# EAGLE design STM32F103_V2 (EAGLE 6.1)
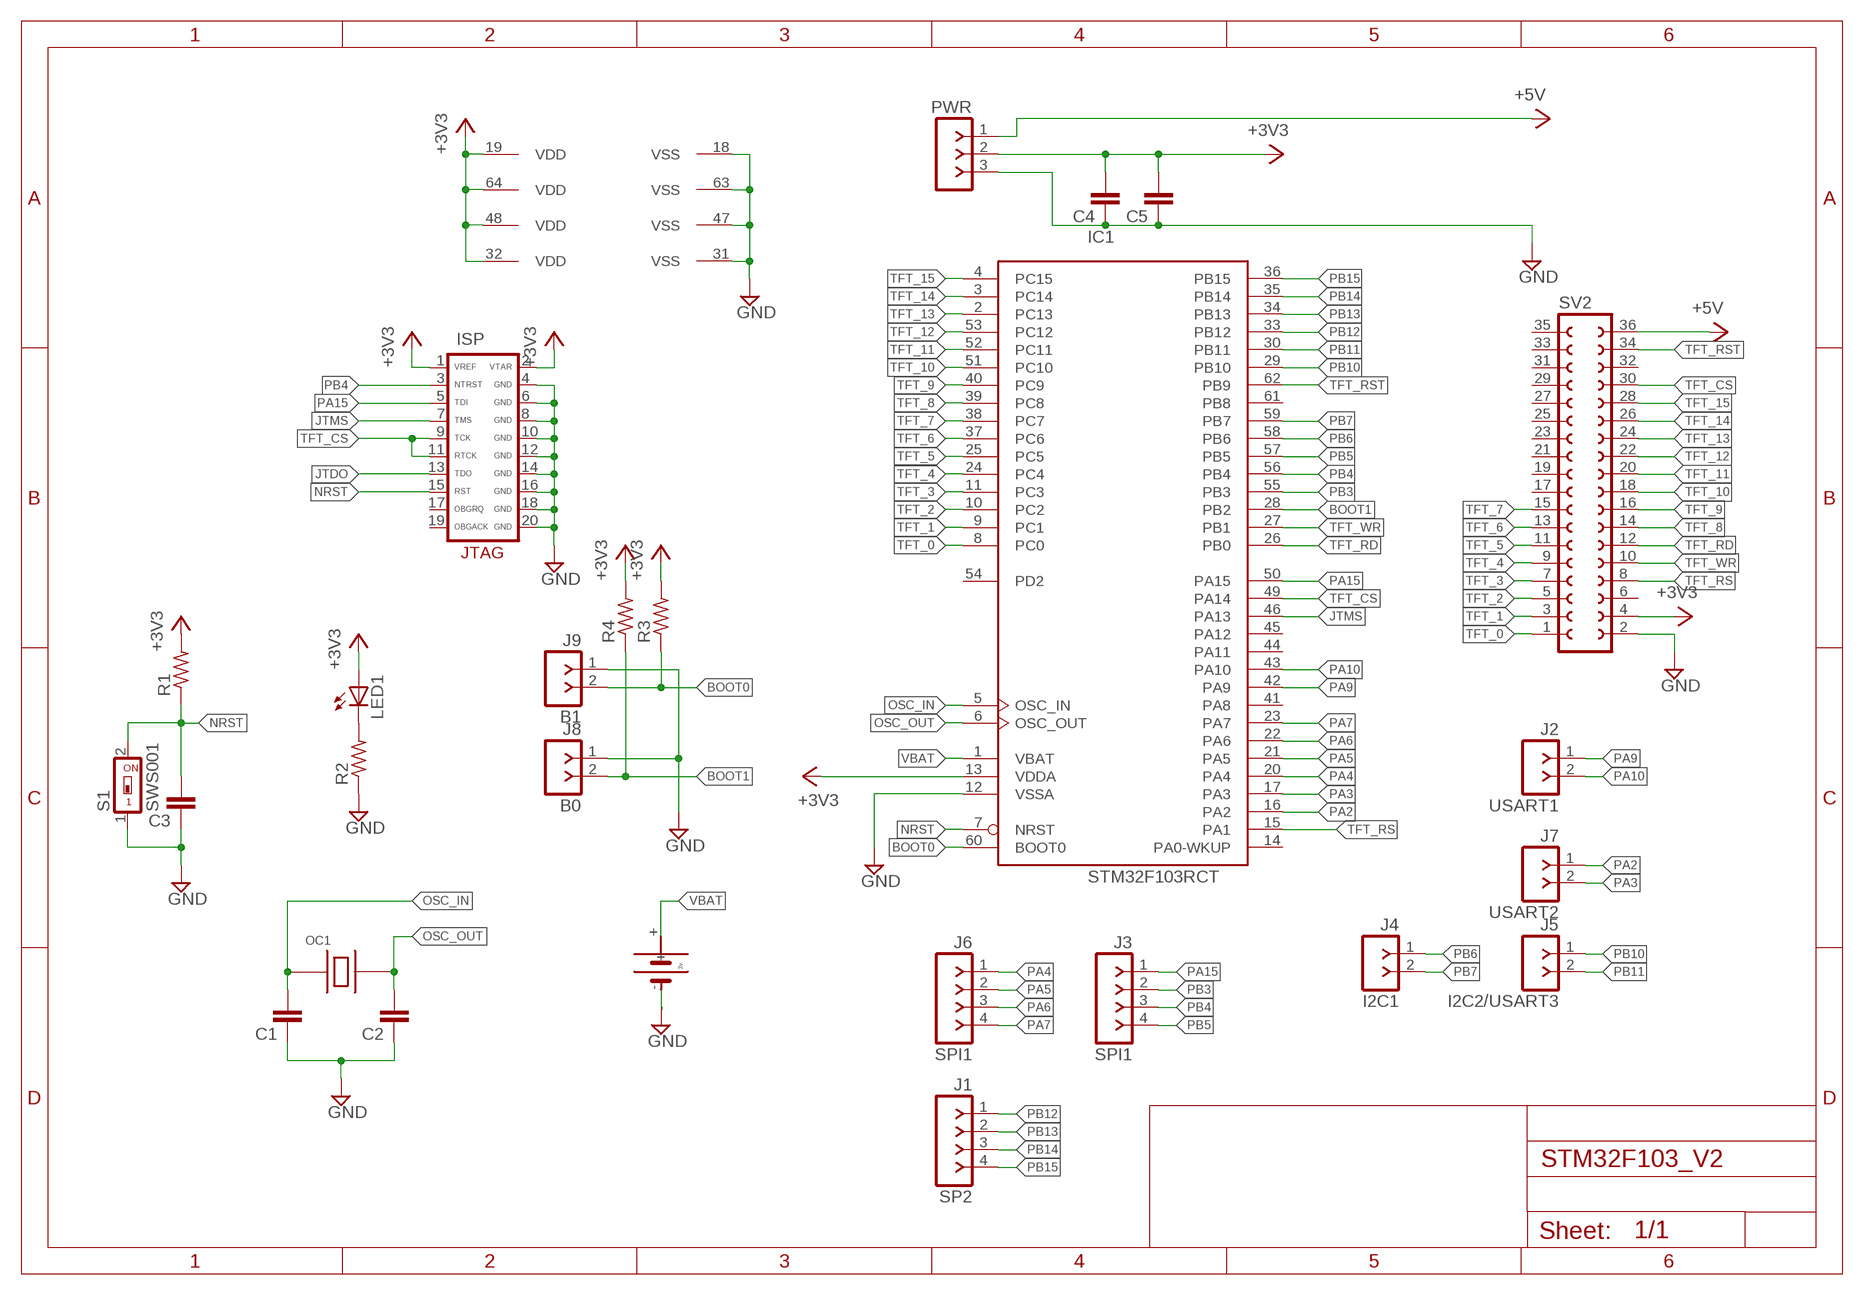
[diagram p0: schematic, sheet 1]

## Parts
C1  C-EUC1206  [C1206]
C2  C-EUC1206  [C1206]
C3  C-EUC1206  [C1206]
C4  C-EUC1206  [C1206]
C5  C-EUC1206  [C1206]
IC1  STM32F103RCT  [LQFP64]
ISP  JTAG  JTAG-ARM-PAK100/2500-20  [PAK100/2500-20]
J1  SP2  F-1X04-SIP-100-40  [SIP-100-04-40]
J2  USART1  F-1X02-SIP-100-40  [SIP-100-02-40]
J3  SPI1  F-1X04-SIP-100-40  [SIP-100-04-40]
J4  I2C1  F-1X02-SIP-100-40  [SIP-100-02-40]
J5  I2C2/USART3  F-1X02-SIP-100-40  [SIP-100-02-40]
J6  SPI1  F-1X04-SIP-100-40  [SIP-100-04-40]
J7  USART2  F-1X02-SIP-100-40  [SIP-100-02-40]
J8  B0  F-1X02-SIP-100-40  [SIP-100-02-40]
J9  B1  F-1X02-SIP-100-40  [SIP-100-02-40]
LED1  LEDSML1206  [SML1206]
OC1  SMAQ-7050B  [IQG7050B]
PWR  F-1X03-SIP-100-40  [SIP-100-03-40]
R1  R-US_R1206  [R1206]
R2  R-US_R1206  [R1206]
R3  R-US_R1206  [R1206]
R4  R-US_R1206  [R1206]
S1  SWS001  [SMS-001]
SV2  FE18-2  [FE18-2]
U$2  1220BATTERY_SF  [1220BATTERY]

## Nets
+3V3: C4.2 C5.2 IC1.13(VDDA) IC1.19(VDD) IC1.32(VDD) IC1.48(VDD) IC1.64(VDD) ISP.1(VREF) ISP.2(VTAR) LED1.A PWR.2 R1.2 R3.2 R4.2 SV2.4
+5V: PWR.1 SV2.36
BOOT0: IC1.60(BOOT0) J9.2 R3.1
BOOT1: IC1.28(PB2) J8.2 R4.1
GND: C1.1 C2.1 C3.1 C4.1 C5.1 IC1.12(VSSA) IC1.18(VSS) IC1.31(VSS) IC1.47(VSS) IC1.63(VSS) ISP.4(GND) ISP.6(GND) ISP.8(GND) ISP.10(GND) ISP.12(GND) ISP.14(GND) ISP.16(GND) ISP.18(GND) ISP.20(GND) J8.1 J9.1 PWR.3 R2.1 S1.1 SV2.2 U$2.-
JTDO: ISP.13(TDO)
JTMS: IC1.46(PA13) ISP.7(TMS)
N$1: LED1.C R2.2
NRST: C3.2 IC1.7(NRST) ISP.15(RST) R1.1 S1.2
OSC_IN: C1.2 IC1.5(OSC_IN) OC1.P$1(PIN1)
OSC_OUT: C2.2 IC1.6(OSC_OUT) OC1.P$3(PIN2)
PA2: IC1.16(PA2) J7.1
PA3: IC1.17(PA3) J7.2
PA4: IC1.20(PA4) J6.1
PA5: IC1.21(PA5) J6.2
PA6: IC1.22(PA6) J6.3
PA7: IC1.23(PA7) J6.4
PA9: IC1.42(PA9) J2.1
PA10: IC1.43(PA10) J2.2
PA15: IC1.50(PA15) ISP.5(TDI) J3.1
PB3: IC1.55(PB3) J3.2
PB4: IC1.56(PB4) ISP.3(NTRST) J3.3
PB5: IC1.57(PB5) J3.4
PB6: IC1.58(PB6) J4.1
PB7: IC1.59(PB7) J4.2
PB10: IC1.29(PB10) J5.1
PB11: IC1.30(PB11) J5.2
PB12: IC1.33(PB12) J1.1
PB13: IC1.34(PB13) J1.2
PB14: IC1.35(PB14) J1.3
PB15: IC1.36(PB15) J1.4
TFT_0: IC1.8(PC0) SV2.1
TFT_1: IC1.9(PC1) SV2.3
TFT_2: IC1.10(PC2) SV2.5
TFT_3: IC1.11(PC3) SV2.7
TFT_4: IC1.24(PC4) SV2.9
TFT_5: IC1.25(PC5) SV2.11
TFT_6: IC1.37(PC6) SV2.13
TFT_7: IC1.38(PC7) SV2.15
TFT_8: IC1.39(PC8) SV2.14
TFT_9: IC1.40(PC9) SV2.16
TFT_10: IC1.51(PC10) SV2.18
TFT_11: IC1.52(PC11) SV2.20
TFT_12: IC1.53(PC12) SV2.22
TFT_13: IC1.2(PC13) SV2.24
TFT_14: IC1.3(PC14) SV2.26
TFT_15: IC1.4(PC15) SV2.28
TFT_CS: IC1.49(PA14) ISP.9(TCK) ISP.11(RTCK) SV2.30
TFT_RD: IC1.26(PB0) SV2.12
TFT_RS: IC1.15(PA1) SV2.8
TFT_RST: IC1.62(PB9) SV2.34
TFT_WR: IC1.27(PB1) SV2.10
VBAT: IC1.1(VBAT) U$2.+
Unconnected: IC1.14(PA0-WKUP) IC1.41(PA8) IC1.44(PA11) IC1.45(PA12) IC1.54(PD2) IC1.61(PB8) ISP.17(OBGRQ) ISP.19(OBGACK) SV2.6 SV2.17 SV2.19 SV2.21 SV2.23 SV2.25 SV2.27 SV2.29 SV2.31 SV2.32 SV2.33 SV2.35

## Library data of the parts
C1-C5 = resistor:C-EU: CAPACITOR, European symbol
IC1 = micro-stm:STM32F103R*T: ARM 32-bit Cortex™-M3 CPU 72 MHz maximum frequency 16 to 1024 Kbytes of Flash memory 6 to 96 kbytes of SRAM 51 GPIOs 2.0 to 3.6 V application supply
ISP = atmel-arm:JTAG-ARM-: JTAG Programming/Debug Connector
J1 J3 J6 = con-headers-jp:F-1X04-: FEMALE HEADER
J2 J4 J5 J7-J9 = con-headers-jp:F-1X02-: FEMALE HEADER
LED1 = led:LED: LED OSRAM: - CHIPLED LG R971, LG N971, LY N971, LG Q971, LY Q971, LO R971, LY R971 LH N974, LH R974 LS Q976, LO Q976, LY Q976 LO Q996 - Hyper CHIPLED LW Q18S LB Q993, LB Q99A, LB R99A - SideLED LS A670, LO A670, LY A670, LG A670, LP A670 LB A673, LV A673, LT A673, LW A673 LH A674 LY A675 LS A676, LA A676, LO A676, LY A676, LW A676 LS A679, LY A679, LG A679 - Hyper Micro SIDELED® LS Y876, LA Y876, LO Y876, LY Y876 LT Y87S - SmartLED LW L88C, LW L88S LB L89C, LB L89S, LG L890 LS L89K, LO L89K, LY L89K LS L896, LA L896, LO L896, LY L896 - TOPLED LS T670, LO T670, LY T670, LG T670, LP T670 LSG T670, LSP T670, LSY T670, LOP T670, LYG T670 LG T671, LOG T671, LSG T671 LB T673, LV T673, LT T673, LW T673 LH T674 LS T676, LA T676, LO T676, LY T676, LB T676, LH T676, LSB T676, LW T676 LB T67C, LV T67C, LT T67C, LS T67K, LO T67K, LY T67K, LW E67C LS E67B, LA E67B, LO E67B, LY E67B, LB E67C, LV E67C, LT E67C LW T67C LS T679, LY T679, LG T679 LS T770, LO T770, LY T770, LG T770, LP T770 LB T773, LV T773, LT T773, LW T773 LH T774 LS E675, LA E675, LY E675, LS T675 LS T776, LA T776, LO T776, LY T776, LB T776 LHGB T686 LT T68C, LB T68C - Hyper Mini TOPLED® LB M676 - Mini TOPLED Santana® LG M470 LS M47K, LO M47K, LY M47K Source: http://www.osram.convergy.de LUXEON: - LUMILED® LXK2-PW12-R00, LXK2-PW12-S00, LXK2-PW14-U00, LXK2-PW14-V00 LXK2-PM12-R00, LXK2-PM12-S00, LXK2-PM14-U00 LXK2-PE12-Q00, LXK2-PE12-R00, LXK2-PE12-S00, LXK2-PE14-T00, LXK2-PE14-U00 LXK2-PB12-K00, LXK2-PB12-L00, LXK2-PB12-M00, LXK2-PB14-N00, LXK2-PB14-P00, LXK2-PB14-Q00 LXK2-PR12-L00, LXK2-PR12-M00, LXK2-PR14-Q00, LXK2-PR14-R00 LXK2-PD12-Q00, LXK2-PD12-R00, LXK2-PD12-S00 LXK2-PH12-R00, LXK2-PH12-S00 LXK2-PL12-P00, LXK2-PL12-Q00, LXK2-PL12-R00 Source: www.luxeon.com KINGBRIGHT: KA-3528ASYC Source: www.kingbright.com
OC1 = osc:SMAQ-7050B: All Quartz SMD Package SMAQ-7050B 4 Pads Pb-Free, RoHs Compliant Company Website:http://www.interquip.com/
PWR = con-headers-jp:F-1X03-: FEMALE HEADER
R1-R4 = rcl:R-US_: RESISTOR, American symbol
S1 = smd-special:SWS001: SMD Dip Switch 1 pol.
SV2 = con-lsta:FE18-2: FEMALE HEADER; OC_FARNELL: unknown; OC_NEWARK: unknown
U$2 = battery2:1220BATTERY_SF

## Board
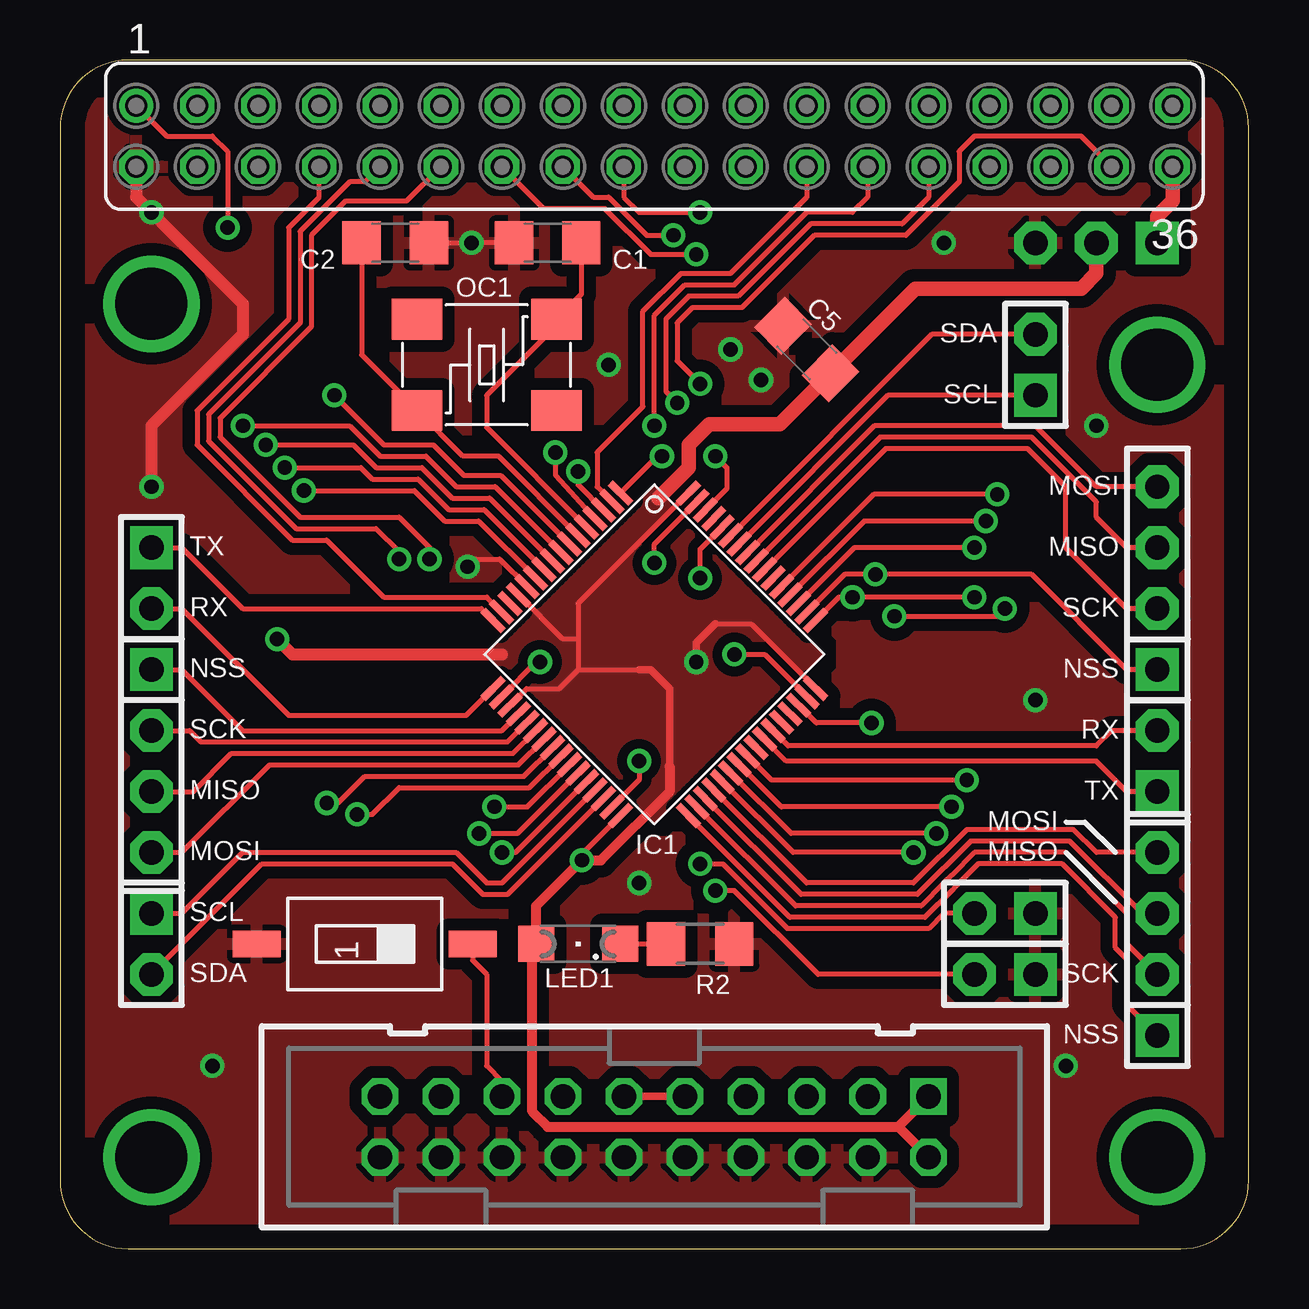
[diagram p1: board, top side]
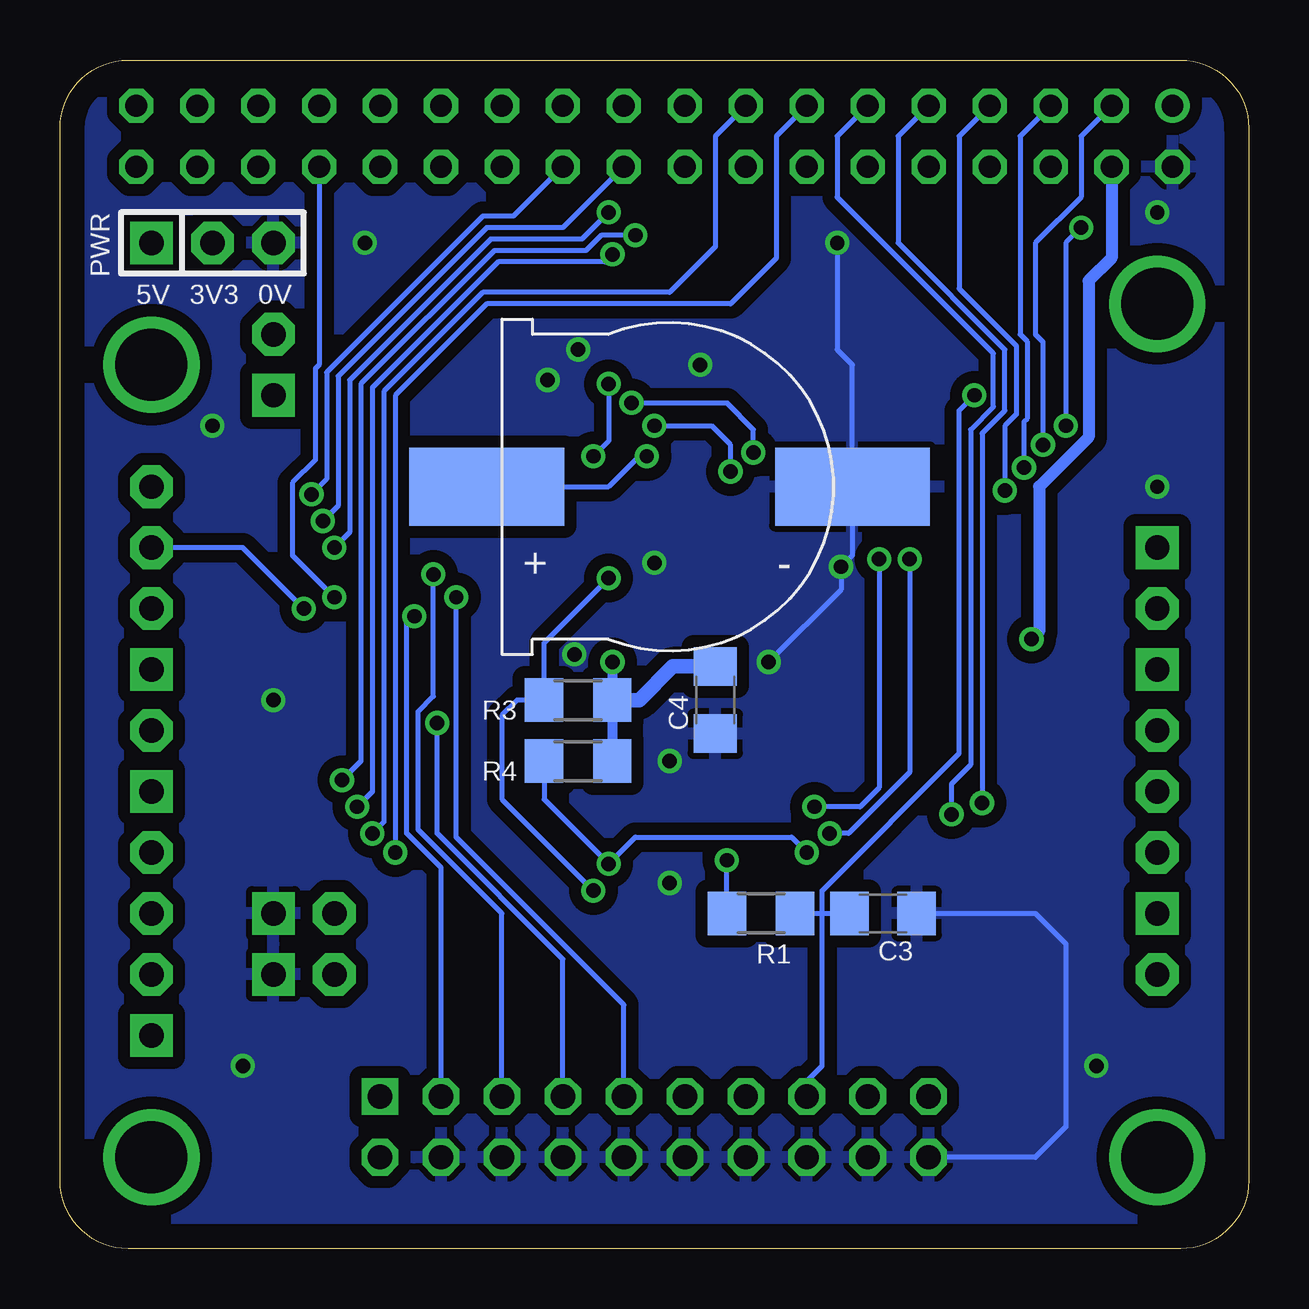
[diagram p2: board, bottom side, seen from below]

Size 49.53 x 49.53 mm. Coordinates in mm from the lower left corner, seen from the top.
Outline: 2.84,0 46.69,0 arc90 49.53,2.84 49.53,46.69 arc90 46.69,49.53 2.84,49.53 arc90 0,46.69 0,2.84 arc90 2.84,0
Copper layers (1*16): Top 0.035mm / dielectric 1.5mm / Bottom 0.035mm
Design rules: minimum track width 6mil, minimum drill 0.6mm, track to track 7mil, track to pad 7mil, pad to pad 7mil, via to via 7mil, smd to smd 7mil, copper to edge 40mil, drill to drill 8mil, minimum pad ring 10mil, minimum via ring 8mil, stop-mask expansion 4mil, vias tented up to drill 0.6mm, thermal gap 10mil

### Footprints (pad centres in the part's own frame; a part is rotated, then mirrored left to right if it is on the bottom)
C1206 = smd 1.6 x 1.8: 1 -1.4,0; 2 1.4,0
LQFP64 = smd 0.3 x 1.2: 1 -3.75,-5.75; 2 -3.25,-5.75; 3 -2.75,-5.75; 4 -2.25,-5.75; 5 -1.75,-5.75; 6 -1.25,-5.75; 7 -0.75,-5.75; 8 -0.25,-5.75; 9 0.25,-5.75; 10 0.75,-5.75; 11 1.25,-5.75; 12 1.75,-5.75; 13 2.25,-5.75; 14 2.75,-5.75; 15 3.25,-5.75; 16 3.75,-5.75; 33 3.75,5.75; 34 3.25,5.75; 35 2.75,5.75; 36 2.25,5.75; 37 1.75,5.75; 38 1.25,5.75; 39 0.75,5.75; 40 0.25,5.75; 41 -0.25,5.75; 42 -0.75,5.75; 43 -1.25,5.75; 44 -1.75,5.75; 45 -2.25,5.75; 46 -2.75,5.75; 47 -3.25,5.75; 48 -3.75,5.75 | smd 1.2 x 0.3: 17 5.75,-3.75; 18 5.75,-3.25; 19 5.75,-2.75; 20 5.75,-2.25; 21 5.75,-1.75; 22 5.75,-1.25; 23 5.75,-0.75; 24 5.75,-0.25; 25 5.75,0.25; 26 5.75,0.75; 27 5.75,1.25; 28 5.75,1.75; 29 5.75,2.25; 30 5.75,2.75; 31 5.75,3.25; 32 5.75,3.75; 49 -5.75,3.75; 50 -5.75,3.25; 51 -5.75,2.75; 52 -5.75,2.25; 53 -5.75,1.75; 54 -5.75,1.25; 55 -5.75,0.75; 56 -5.75,0.25; 57 -5.75,-0.25; 58 -5.75,-0.75; 59 -5.75,-1.25; 60 -5.75,-1.75; 61 -5.75,-2.25; 62 -5.75,-2.75; 63 -5.75,-3.25; 64 -5.75,-3.75
PAK100/2500-20 = drill 1.016 pad 1.422 square: 1 -11.43,-1.27 | drill 1.016 pad 1.422 octagon: 2 -11.43,1.27; 3 -8.89,-1.27; 4 -8.89,1.27; 5 -6.35,-1.27; 6 -6.35,1.27; 7 -3.81,-1.27; 8 -3.81,1.27; 9 -1.27,-1.27; 10 -1.27,1.27; 11 1.27,-1.27; 12 1.27,1.27; 13 3.81,-1.27; 14 3.81,1.27; 15 6.35,-1.27; 16 6.35,1.27; 17 8.89,-1.27; 18 8.89,1.27; 19 11.43,-1.27; 20 11.43,1.27
SIP-100-04-40 = drill 1.016 pad 1.778 square: 1 -3.81,0 | drill 1.016 pad 1.778 octagon: 2 -1.27,0; 3 1.27,0; 4 3.81,0
SIP-100-02-40 = drill 1.016 pad 1.778 square: 1 -1.27,0 | drill 1.016 pad 1.778 octagon: 2 1.27,0
SML1206 = smd 1.5 x 1.5: A 1.75,0; C -1.75,0
IQG7050B = smd 2.1 x 1.7: P$1 -2.9,-1.9; P$2 2.9,-1.9; P$3 2.9,1.9; P$4 -2.9,1.9
SIP-100-03-40 = drill 1.016 pad 1.778 square: 1 -2.54,0 | drill 1.016 pad 1.778 octagon: 2 0,0; 3 2.54,0
R1206 = smd 1.6 x 1.803: 1 -1.422,0; 2 1.422,0
SMS-001 = smd 1.092 x 2.007: 1 0,-4.496; 2 0,4.496
FE18-2 = drill 0.914: 1 -21.59,1.27 | drill 0.914 octagon: 2 -21.59,-1.27; 3 -19.05,1.27; 4 -19.05,-1.27; 5 -16.51,1.27; 6 -16.51,-1.27; 7 -13.97,1.27; 8 -13.97,-1.27; 9 -11.43,1.27; 10 -11.43,-1.27; 11 -8.89,1.27; 12 -8.89,-1.27; 13 -6.35,1.27; 14 -6.35,-1.27; 15 -3.81,1.27; 16 -3.81,-1.27; 17 -1.27,1.27; 18 -1.27,-1.27; 19 1.27,1.27; 20 1.27,-1.27; 21 3.81,1.27; 22 3.81,-1.27; 23 6.35,1.27; 24 6.35,-1.27; 25 8.89,1.27; 26 8.89,-1.27; 27 11.43,1.27; 28 11.43,-1.27; 29 13.97,1.27; 30 13.97,-1.27; 31 16.51,1.27; 32 16.51,-1.27; 33 19.05,1.27; 34 19.05,-1.27; 35 21.59,1.27; 36 21.59,-1.27
1220BATTERY = smd 6.452 x 3.251: + -6.985,0; - 8.255,0

### Placement (x,y rotation side)
C1  20.32,41.91 0 top
C2  13.97,41.91 180 top
C3  15.24,13.97 180 bottom
C4  22.23,22.86 90 bottom
C5  31.11,37.47 315 top
IC1  24.77,24.77 225 top
ISP  24.77,5.08 180 top
J1  45.72,12.7 90 top
J2  45.72,20.32 90 top
J3  45.72,27.94 90 top
J4  40.64,36.83 90 top
J5  3.81,12.7 270 top
J6  3.81,20.32 270 top
J7  3.81,27.94 270 top
J8  39.37,13.97 180 top
J9  39.37,11.43 180 top
LED1  21.59,12.7 180 top
OC1  17.78,36.83 180 top
PWR  43.18,41.91 0 bottom
R1  20.32,13.97 180 bottom
R2  26.67,12.7 180 top
R3  27.94,22.86 0 bottom
R4  27.94,20.32 0 bottom
S1  12.7,12.7 270 top
SV2  24.77,46.35 0 top
U$2  24.77,31.75 0 bottom

### Tracks (layer width: path | path; a pad name or v marks a point on that pad's centre or on a via)
+3V3  (via drill 0.6)
  Top 0.203: IC1.19 19.45,23.34 20.8,23.34 21.59,24.13 | IC1.64 21.59,26.89 21.59,25.4 | 27.3,26.04 28.8,26.04 IC1.48 | 21.59,25.4 21.59,24.13 | 21.59,24.13 24.13,24.13 | v21.74,16.19 21.74,16.44 IC1.32 | 21.59,25.4 20.95,25.4 IC1.13
  Top 0.305: 25.4,20.1 25.4,23.34 24.61,24.13 24.13,24.13 | v26.51,24.45 26.51,25.24 27.3,26.04
  Top 0.406: 25.4,20.1 25.4,19.05 22.54,16.19 v21.74,16.19 19.84,14.28 LED1.A 19.68,12.54 19.68,5.71 20.32,5.08 34.92,5.08 | 34.92,5.08 ISP.1 | ISP.2 34.92,5.08
  Top 0.508: v9.05,25.4 9.68,24.77 18.41,24.77
  Top 0.61: PWR.2 43.18,40.64 42.55,40.01 35.63,40.01 C5.2 29.99,34.36 27.06,34.36 26.19,33.5 26.19,32.54 24.92,31.27
  Bottom 0.203: R1.2 v21.74,16.19
  Bottom 0.305: v26.52,24.44 v26.51,24.45
  Bottom 0.406: v26.52,24.44 R3.2 R4.2
  Bottom 0.508: SV2.4 5.71,41.27 6.67,40.32 6.67,33.81 8.73,31.75 8.73,25.72 v9.05,25.4
  Bottom 0.61: C4.2 24,24.26 25.4,22.86 R3.2
  pour Top (isolate 0.406): 17.78,24.77 24.77,31.75 31.75,24.77 24.77,17.78
+5V
  Top 0.61: PWR.1 45.72,43.02 46.35,43.66 SV2.36
BOOT0  (via drill 0.6)
  Top 0.203: v26.67,27.94 26.67,29.14 IC1.60 | J9.2 31.59,11.43 28.1,14.92 v27.3,14.92
  Bottom 0.203: v26.67,27.94 29.36,25.25 R3.1 30.48,22.86 31.11,22.23 31.11,18.73 v27.3,14.92
BOOT1  (via drill 0.6)
  Top 0.203: v18.41,16.51 18.98,16.51 IC1.28 | v26.67,16.03 27.62,16.03 30.32,13.34 36.2,13.34 36.83,13.97 J8.2
  Bottom 0.203: v18.41,16.51 19.05,17.14 25.56,17.14 v26.67,16.03 29.36,18.73 R4.1
GND  (via drill 0.6)
  Top 0.203: C2.1 v17.14,41.91 C1.1 | IC1.18 19.85,24.45 v20,24.45 | v24.13,20.32 24.13,19.53 IC1.31 | v28.1,24.77 29.36,24.77 IC1.47 | v24.77,28.57 24.77,29.36 IC1.63 | v16.99,28.42 17.3,28.73 18.32,28.73 IC1.12
  Top 0.508: SV2.2 3.17,43.81 7.62,39.37 7.62,38.1 3.81,34.29 v3.81,31.75
  Bottom 0.203: v17.14,41.91 17.14,37.47 16.51,36.83 U$2.- 16.51,28.89 v16.99,28.42 16.99,27.46 v20,24.45 | C3.1 8.89,13.97 7.62,12.7 7.62,5.08 8.89,3.81 ISP.20
  other vias: 24.13,15.24 40.64,22.86 22.86,36.83 29.21,36.2 36.83,41.91 3.81,43.18 41.91,7.62 6.35,7.62 43.18,34.29 27.94,37.47
  pour Top (isolate 0.508, rank 3): 0,49.53 49.53,49.53 50.01,0 0,0
  pour Bottom (isolate 0.508, rank 2): 0,49.53 49.53,49.53 49.53,0 0,0
JTMS  (via drill 0.6)
  Top 0.203: v33.81,21.91 31.51,21.91 IC1.46
  Bottom 0.203: ISP.7 28.57,12.06 33.81,17.3 v33.81,21.91
N$1
  Top 0.203: LED1.C R2.2
N$2  (via drill 3)
  other vias: 45.72,3.81
N$3  (via drill 3)
  other vias: 45.72,36.83
N$4  (via drill 3)
  other vias: 3.81,39.37
NRST  (via drill 0.6)
  Top 0.203: v11.43,35.56 13.49,33.5 15.56,33.5 16.83,32.23 18.36,32.23 IC1.7 | S1.2 17.2,12.01 17.78,11.43 17.78,7.62 18.41,6.99 ISP.15
  Bottom 0.203: R1.1 17.78,13.97 | 17.78,13.97 17.78,14.92 12.06,20.64 12.06,34.92 v11.43,35.56 | 17.78,13.97 C3.2 | ISP.15 18.41,6.99 17.78,7.62 17.78,13.97
OSC_IN
  Top 0.203: C1.2 21.72,39.77 OC1.P$1 20.68,38.46 17.78,35.56 17.78,34.23 IC1.5
OSC_OUT
  Top 0.203: IC1.6 18.28,33.02 16.79,33.02 OC1.P$3 12.57,37.24 C2.2
PA2
  Top 0.203: J7.1 5.08,29.21 7.62,26.67 17.56,26.67 IC1.16
PA3
  Top 0.203: J7.2 5.08,26.67 9.53,22.23 16.92,22.23 IC1.17
PA4
  Top 0.203: J6.1 5.08,24.13 7.62,21.59 18.41,21.59 IC1.20
PA5
  Top 0.203: J6.2 5.4,21.59 5.87,21.11 18.64,21.11 IC1.21
PA6
  Top 0.203: J6.3 5.56,19.05 7.14,20.64 18.87,20.64 IC1.22
PA7
  Top 0.203: J6.4 5.08,16.51 8.73,20.16 19.1,20.16 IC1.23
PA9
  Top 0.203: J2.1 44.45,19.05 43.18,20.32 30.27,20.32 IC1.42
PA10
  Top 0.203: J2.2 43.81,21.59 43.18,20.95 30.34,20.95 IC1.43
PA15  (via drill 0.6)
  Top 0.203: J3.1 44.45,24.13 40.48,28.1 v33.97,28.1 32.7,28.1 IC1.50
  Bottom 0.203: ISP.5 31.11,13.97 34.61,17.46 34.61,22.38 33.97,23.02 v33.97,28.1
PB3
  Top 0.203: J3.2 44.45,26.67 41.91,29.21 41.91,31.75 40.32,33.34 34.4,33.34 IC1.55
PB4  (via drill 0.6)
  Top 0.203: J3.3 44.45,29.21 43.18,30.48 43.18,31.11 40.48,33.81 34.17,33.81 IC1.56 | v34.77,26.35 39.05,26.35 v39.37,26.67
  Bottom 0.203: ISP.3 33.66,15.88 35.08,17.3 35.08,26.04 v34.77,26.35 | v39.37,26.67 41.91,29.21 J3.3
PB5
  Top 0.203: IC1.57 33.94,34.29 40.64,34.29 43.18,31.75 J3.4
PB6
  Top 0.203: J4.1 34.5,35.56 IC1.58
PB7
  Top 0.203: J4.2 36.33,38.1 IC1.59
PB10
  Top 0.203: J5.1 5.08,13.97 7.62,16.51 16.51,16.51 17.78,15.24 18.42,15.24 IC1.29
PB11
  Top 0.203: J5.2 8.41,16.03 16.35,16.03 17.62,14.76 18.65,14.76 IC1.30
PB12
  Top 0.203: J1.1 44.45,10.16 44.45,12.06 43.97,12.54 43.97,13.81 41.75,16.03 38.26,16.03 37.31,15.08 37.15,14.92 36.04,13.81 30.41,13.81 IC1.33
PB13
  Top 0.203: IC1.34 30.65,14.29 35.88,14.29 36.83,15.24 37.15,15.56 38.1,16.51 41.91,16.51 44.45,13.97 44.45,12.7 J1.2
PB14
  Top 0.203: IC1.35 30.88,14.76 35.72,14.76 37.94,16.99 42.07,16.99 45.09,13.97 J1.3
PB15
  Top 0.203: IC1.36 31.11,15.24 35.56,15.24 37.78,17.46 42.23,17.46 43.18,16.51 J1.4
S$1  (via drill 3)
  other vias: 3.81,3.81
TFT_0  (via drill 0.6)
  Top 0.203: SV2.1 4.45,46.35 6.35,46.35 6.99,45.72 v6.99,42.55 | v7.62,34.29 12.06,34.29 13.34,33.02 15.24,33.02 16.51,31.75 18.13,31.75 IC1.8
  Bottom 0.203: v6.99,42.55 7.62,41.91 v7.62,34.29
TFT_1  (via drill 0.6)
  Top 0.203: v8.57,33.5 12.22,33.5 13.18,32.54 15.08,32.54 16.35,31.27 17.9,31.27 IC1.9
  Bottom 0.203: SV2.3 6.99,46.35 6.99,43.81 8.89,41.91 8.89,38.1 8.57,37.78 v8.57,33.5
TFT_2  (via drill 0.6)
  Top 0.203: v9.37,32.54 12.54,32.54 13.02,32.07 14.92,32.07 16.19,30.8 17.67,30.8 IC1.10
  Bottom 0.203: SV2.5 9.53,46.35 9.53,38.1 9.21,37.78 9.21,34.61 9.37,34.45 v9.37,32.54
TFT_3  (via drill 0.6)
  Top 0.203: v10.16,31.59 14.76,31.59 16.03,30.32 17.44,30.32 IC1.11
  Bottom 0.203: SV2.7 12.06,46.35 12.06,40.01 9.68,37.62 9.68,34.77 10.16,34.29 v10.16,31.59
TFT_4  (via drill 0.6)
  Top 0.203: v11.11,18.57 11.59,18.57 12.7,19.68 19.33,19.68 IC1.24
  Bottom 0.203: SV2.9 14.61,46.35 14.61,41.91 10.16,37.47 10.16,34.92 11.11,33.97 v11.11,18.57
TFT_5  (via drill 0.6)
  Top 0.203: v12.38,18.1 13.02,18.1 14.13,19.21 19.56,19.21 IC1.25
  Bottom 0.203: SV2.11 17.14,46.35 17.14,43.81 10.64,37.31 10.64,35.08 11.59,34.13 11.59,20.16 12.38,19.37 v12.38,18.1
TFT_6  (via drill 0.6)
  Top 0.203: v35.56,16.51 30.55,16.51 IC1.37
  Bottom 0.203: SV2.13 19.68,46.35 19.68,41.27 21.59,39.37 31.75,39.37 35.56,35.56 v35.56,16.51
TFT_7  (via drill 0.6)
  Top 0.203: IC1.38 30.46,17.3 v36.51,17.3
  Bottom 0.203: SV2.15 22.23,46.35 22.23,41.75 24.13,39.85 31.91,39.85 36.04,35.72 36.04,17.78 v36.51,17.3
TFT_8  (via drill 0.6)
  Top 0.203: v26.51,41.43 24.61,41.43 22.7,43.34 20.16,43.34 SV2.14 | IC1.39 30.05,18.41 v37.15,18.41
  Bottom 0.203: v26.51,41.43 26.83,41.12 31.27,41.12 36.51,35.88 36.51,19.05 v37.15,18.41
TFT_9  (via drill 0.6)
  Top 0.203: SV2.16 22.23,43.81 22.86,43.81 24.45,42.23 v25.56,42.23 | IC1.40 29.65,19.53 v37.78,19.53
  Bottom 0.203: v25.56,42.23 26.99,42.23 27.62,41.59 31.43,41.59 36.99,36.04 36.99,20.32 v37.78,19.53
TFT_10  (via drill 0.6)
  Top 0.203: SV2.18 23.5,43.81 24.13,43.18 v26.67,43.18 | v38.1,29.21 33.1,29.21 IC1.51
  Bottom 0.203: v26.67,43.18 27.78,42.07 31.59,42.07 37.47,36.2 37.47,29.84 v38.1,29.21
TFT_11  (via drill 0.6)
  Top 0.203: v38.58,30.32 33.5,30.32 IC1.52
  Bottom 0.203: SV2.20 28.57,42.55 31.75,42.55 37.94,36.35 37.94,30.96 v38.58,30.32
TFT_12  (via drill 0.6)
  Top 0.203: v39.05,31.43 33.91,31.43 IC1.53
  Bottom 0.203: SV2.22 30.64,43.02 31.91,43.02 38.42,36.51 38.42,32.07 v39.05,31.43
TFT_13
  Top 0.203: SV2.24 31.11,43.81 27.94,40.64 25.88,40.64 24.29,39.05 24.29,35.08 22.38,33.18 22.38,31.74 IC1.2
TFT_14  (via drill 0.6)
  Top 0.203: SV2.26 33.66,43.81 33.02,43.18 31.11,43.18 28.1,40.16 26.04,40.16 24.77,38.89 v24.77,34.29 | v21.59,32.38 21.59,31.83 IC1.3
  Bottom 0.203: v21.59,32.38 21.59,33.5 22.38,34.29 v24.77,34.29
TFT_15  (via drill 0.6)
  Top 0.203: SV2.28 36.2,43.81 35.08,42.7 31.27,42.7 28.26,39.69 26.19,39.69 25.24,38.73 25.24,35.72 v25.72,35.24 | v20.64,33.18 20.64,32.23 IC1.4
  Bottom 0.203: v25.72,35.24 21.75,35.24 20.64,34.13 v20.64,33.18
TFT_CS  (via drill 0.6)
  Top 0.203: v38.1,27.15 v33.02,27.15 32.45,27.15 IC1.49
  Top 0.305: ISP.11 ISP.9
  Bottom 0.203: SV2.30 38.73,36.83 38.89,36.67 38.89,32.86 39.85,31.91 39.85,28.89 v38.1,27.15 | ISP.9 26.04,10.16 33.02,17.14 v33.02,27.15
TFT_RD  (via drill 0.6)
  Top 0.203: v15.4,28.73 15.4,29.21 14.13,30.48 10,30.48 6.67,33.81 6.67,34.61 10.48,38.42 10.48,42.23 11.91,43.66 14.45,43.66 SV2.12 | v18.1,18.41 19.48,18.41 IC1.26
  Bottom 0.203: v15.4,28.73 15.4,19.21 16.19,18.41 v18.1,18.41
TFT_RS
  Top 0.203: SV2.8 10.79,43.81 9.53,42.55 9.53,38.73 5.71,34.92 5.71,33.5 9.68,29.53 11.11,29.53 13.49,27.15 17.79,27.15 IC1.15
TFT_RST  (via drill 0.6)
  Top 0.203: SV2.34 42.55,46.35 38.1,46.35 37.47,45.72 37.47,44.45 35.24,42.23 31.43,42.23 28.42,39.21 26.35,39.21 25.72,38.58 25.72,36.99 v26.67,36.04 | v27.3,33.02 27.78,32.54 27.78,31.67 IC1.62
  Bottom 0.203: v26.67,36.04 26.67,33.66 v27.3,33.02
TFT_WR  (via drill 0.6)
  Top 0.203: v14.13,28.73 14.13,29.05 13.18,30 9.84,30 6.19,33.66 6.19,34.77 10,38.58 10,42.39 12.06,44.45 12.7,44.45 SV2.10 | v17.46,17.3 19.07,17.3 IC1.27
  Bottom 0.203: v14.13,28.73 14.13,19.84 16.67,17.3 v17.46,17.3
VBAT  (via drill 0.6)
  Top 0.203: v25.08,33.02 24.89,33.02 IC1.1
  Bottom 0.203: U$2.+ 26.67,31.75 25.4,33.02 v25.08,33.02

### Text on the board
tPlace: SDA | SCL | MOSI | MISO | TX | SCK | RX | NSS | NSS | RX | SCK | TX | MISO | MOSI | MISO | MOSI | SCL | SCK | SDA | NSS
bPlace: 0V | 3V3 | 5V